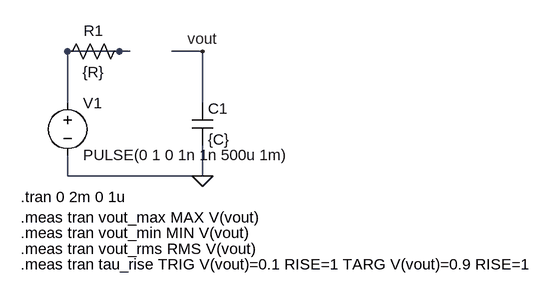
[diagram p0: schematic rc_lowpass.asc]
rc_lowpass.asc, the LTspice schematic file:
Version 4
SHEET 1 880 680
WIRE 192 96 96 96
WIRE 304 96 256 96
WIRE 96 176 96 96
WIRE 304 176 304 96
WIRE 96 288 96 256
WIRE 304 288 304 240
WIRE 304 288 96 288
FLAG 304 288 0
FLAG 304 96 vout
SYMBOL voltage 96 160 R0
WINDOW 123 0 0 Left 0
WINDOW 39 0 0 Left 0
SYMATTR InstName V1
SYMATTR Value PULSE(0 1 0 1n 1n 500u 1m)
SYMBOL res 192 80 R90
WINDOW 0 0 56 VBottom 2
WINDOW 3 32 56 VTop 2
SYMATTR InstName R1
SYMATTR Value {R}
SYMBOL cap 288 176 R0
SYMATTR InstName C1
SYMATTR Value {C}
TEXT 24 320 Left 2 !.tran 0 2m 0 1u
TEXT 24 352 Left 2 !.meas tran vout_max MAX V(vout)
TEXT 24 376 Left 2 !.meas tran vout_min MIN V(vout)
TEXT 24 400 Left 2 !.meas tran vout_rms RMS V(vout)
TEXT 24 424 Left 2 !.meas tran tau_rise TRIG V(vout)=0.1 RISE=1 TARG V(vout)=0.9 RISE=1

The netlist it stands for:
* rc_lowpass.asc
V1 N001 0 PULSE(0 1 0 1n 1n 500u 1m)
R1 N001 N001 {R}
C1 vout 0 {C}
.tran 0 2m 0 1u
.meas tran vout_max MAX V(vout)
.meas tran vout_min MIN V(vout)
.meas tran vout_rms RMS V(vout)
.meas tran tau_rise TRIG V(vout)=0.1 RISE=1 TARG V(vout)=0.9 RISE=1
.backanno
.end